# EAGLE design Adafruit MAX9744 (EAGLE 9.2.1)
AUTHOR: K. Townsend
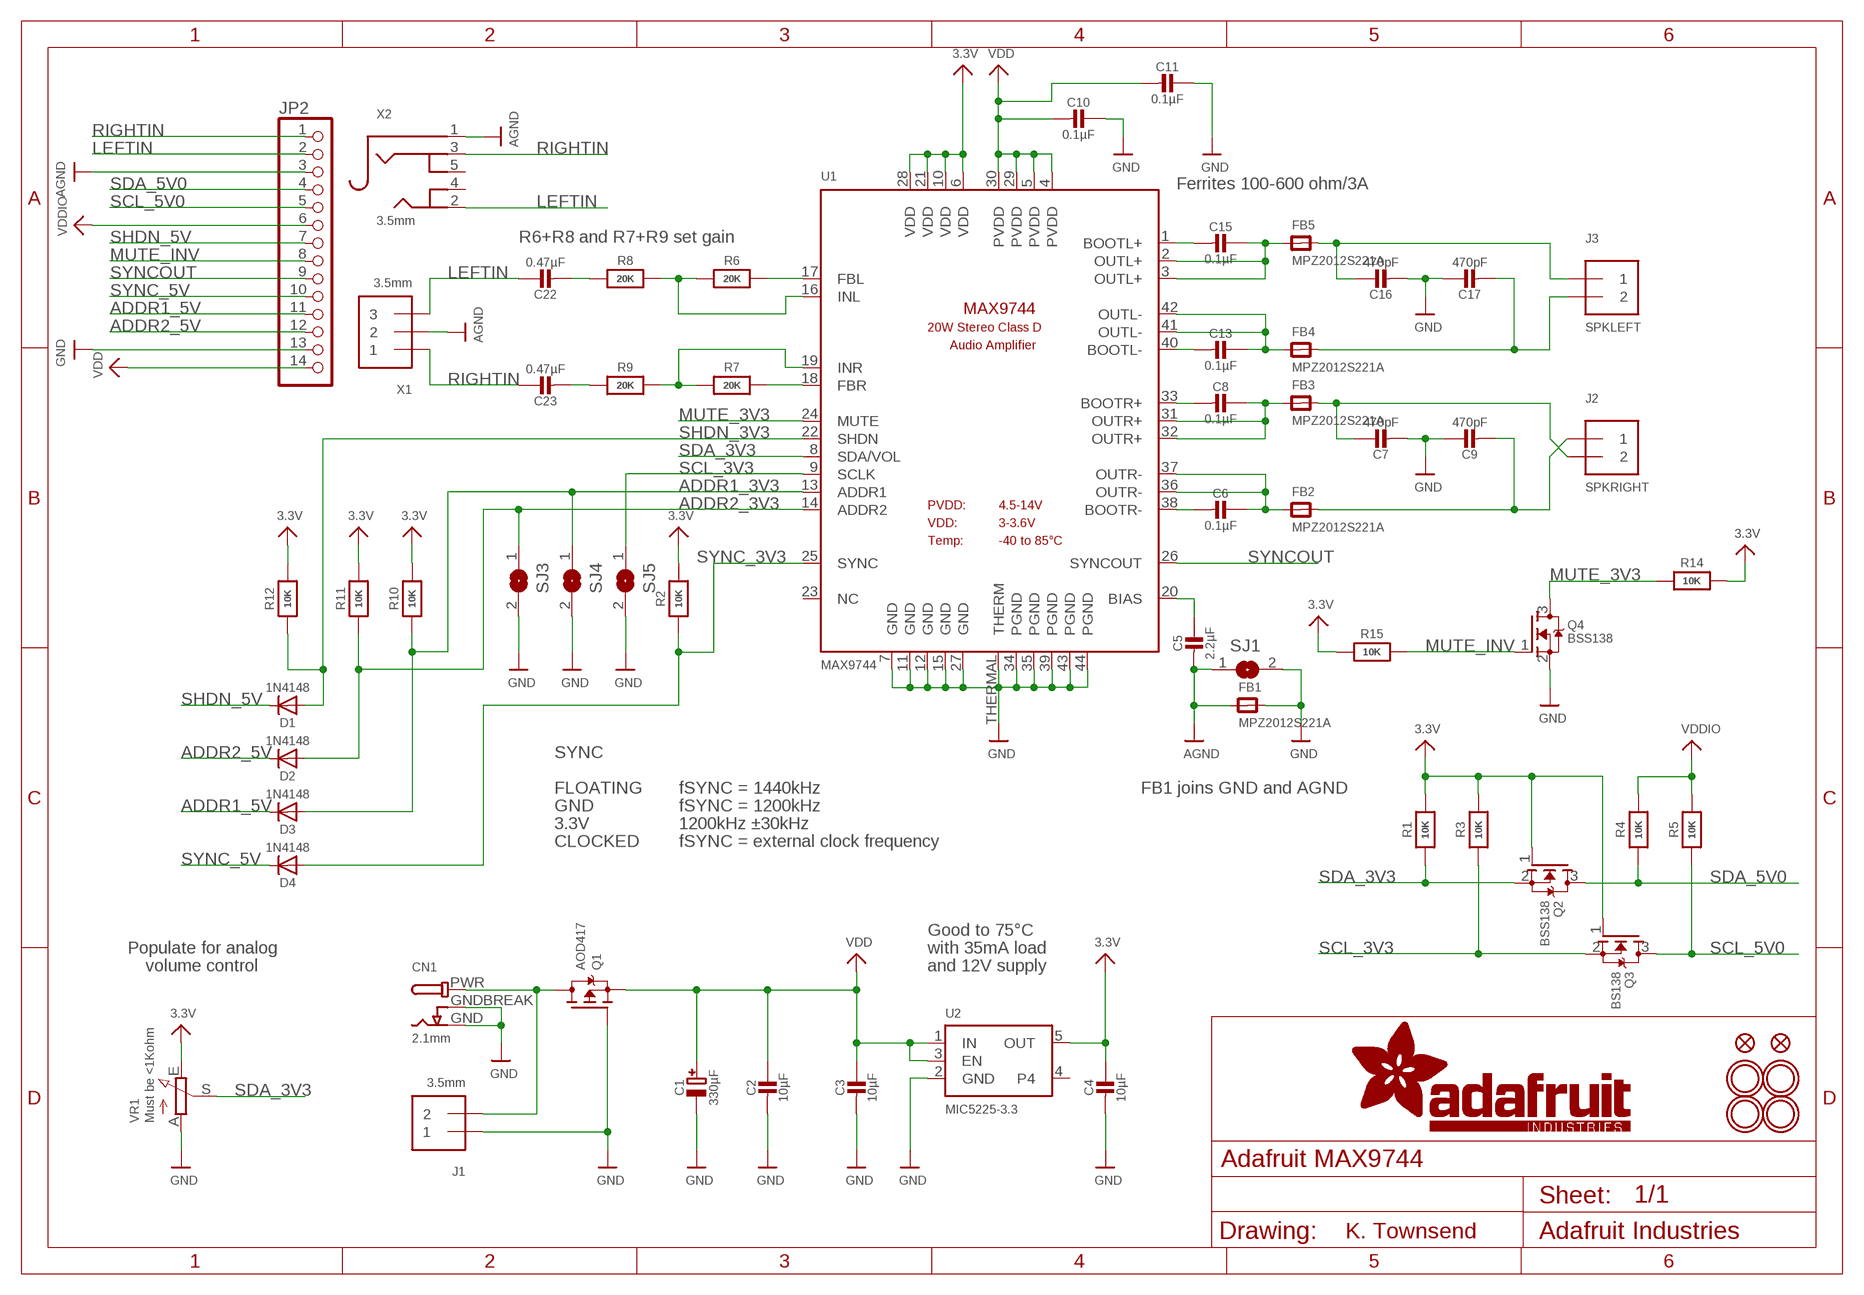
[diagram p0: schematic, sheet 1]

## Parts
C1  330µF  CAP_ELECTROLYTICPTH_3.5MMGRID_8MMDIA  [CELEC_3.5MM_8MM]
C2  10µF  CAP_CERAMIC0805-NOOUTLINE  [0805-NO]
C3  10µF  CAP_CERAMIC0805-NOOUTLINE  [0805-NO]
C4  10µF  CAP_CERAMIC0805-NOOUTLINE  [0805-NO]
C5  2.2µF  CAP_CERAMIC0805-NOOUTLINE  [0805-NO]
C6  0.1µF  CAP_CERAMIC0805-NOOUTLINE  [0805-NO]
C7  470pF  CAP_CERAMIC0805-NOOUTLINE  [0805-NO]
C8  0.1µF  CAP_CERAMIC0805-NOOUTLINE  [0805-NO]
C9  470pF  CAP_CERAMIC0805-NOOUTLINE  [0805-NO]
C10  0.1µF  CAP_CERAMIC0805-NOOUTLINE  [0805-NO]
C11  0.1µF  CAP_CERAMIC0805-NOOUTLINE  [0805-NO]
C13  0.1µF  CAP_CERAMIC0805-NOOUTLINE  [0805-NO]
C15  0.1µF  CAP_CERAMIC0805-NOOUTLINE  [0805-NO]
C16  470pF  CAP_CERAMIC0805-NOOUTLINE  [0805-NO]
C17  470pF  CAP_CERAMIC0805-NOOUTLINE  [0805-NO]
C22  0.47µF  CAP_CERAMIC0805-NOOUTLINE  [0805-NO]
C23  0.47µF  CAP_CERAMIC0805-NOOUTLINE  [0805-NO]
CN1  2.1mm  DCBARRELSMT_CORRECT  [DCJACK_2MM_SMT]
D1  1N4148  DIODESOD-323  [SOD-323]
D2  1N4148  DIODESOD-323  [SOD-323]
D3  1N4148  DIODESOD-323  [SOD-323]
D4  1N4148  DIODESOD-323  [SOD-323]
FB1  MPZ2012S221A  FERRITE_0805  [_0805]
FB2  MPZ2012S221A  FERRITE_0805  [_0805]
FB3  MPZ2012S221A  FERRITE_0805  [_0805]
FB4  MPZ2012S221A  FERRITE_0805  [_0805]
FB5  MPZ2012S221A  FERRITE_0805  [_0805]
FID1  FIDUCIAL""  [FIDUCIAL_1MM]
FID2  FIDUCIAL""  [FIDUCIAL_1MM]
J1  3.5mm  TERMBLOCK_1X2  [TERMBLOCK_1X2-3.5MM]
J2  SPKRIGHT  TERMBLOCK_1X2  [TERMBLOCK_1X2-3.5MM]
J3  SPKLEFT  TERMBLOCK_1X2  [TERMBLOCK_1X2-3.5MM]
JP2  HEADER-1X14  [1X14_ROUND70]
Q1  AOD417  MOSFET-PTO252  [TO252]
Q2  BSS138  MOSFET-NWIDE  [SOT23-WIDE]
Q3  BS138  MOSFET-NWIDE  [SOT23-WIDE]
Q4  BSS138  MOSFET-NWIDE  [SOT23-WIDE]
R1  10K  RESISTOR0805_NOOUTLINE  [0805-NO]
R2  10K  RESISTOR_0805MP  [_0805MP]
R3  10K  RESISTOR0805_NOOUTLINE  [0805-NO]
R4  10K  RESISTOR0805_NOOUTLINE  [0805-NO]
R5  10K  RESISTOR0805_NOOUTLINE  [0805-NO]
R6  20K  RESISTOR0805_NOOUTLINE  [0805-NO]
R7  20K  RESISTOR0805_NOOUTLINE  [0805-NO]
R8  20K  RESISTOR0805_NOOUTLINE  [0805-NO]
R9  20K  RESISTOR0805_NOOUTLINE  [0805-NO]
R10  10K  RESISTOR_0805MP  [_0805MP]
R11  10K  RESISTOR_0805MP  [_0805MP]
R12  10K  RESISTOR0805_NOOUTLINE  [0805-NO]
R14  10K  RESISTOR_0805MP  [_0805MP]
R15  10K  RESISTOR_0805MP  [_0805MP]
SJ1  SOLDERJUMPER  [SOLDERJUMPER_ARROW_NOPASTE]
SJ3  SOLDERJUMPER  [SOLDERJUMPER_ARROW_NOPASTE]
SJ4  SOLDERJUMPER  [SOLDERJUMPER_ARROW_NOPASTE]
SJ5  SOLDERJUMPER  [SOLDERJUMPER_ARROW_NOPASTE]
U1  MAX9744  AUDIOAMP_MAX9744  [TQFN44_7MM]
U2  MIC5225-3.3  VREG_SOT23-5  [SOT23-5]
U$29  MOUNTINGHOLE2.5_THICK  [MOUNTINGHOLE_2.5_PLATED_THICK]
U$38  MOUNTINGHOLE2.5_THICK  [MOUNTINGHOLE_2.5_PLATED_THICK]
U$39  MOUNTINGHOLE2.5_THICK  [MOUNTINGHOLE_2.5_PLATED_THICK]
U$40  MOUNTINGHOLE2.5_THICK  [MOUNTINGHOLE_2.5_PLATED_THICK]
VR1  Must be <1Kohm  TRIMPOT100MIL  [TRIMPOT_100MILPTH]
X1  3.5mm  TERMBLOCK_1X3  [TERMBLOCK_1X3-3.5MM]
X2  3.5mm  AUDIO_3.5MMJACK  [4UCONN_19269]

## Nets
3.3V: C4.1 Q2.1(G) Q3.1(G) R1.2 R2.2 R3.2 R10.2 R11.2 R12.2 R14.2 R15.1 U1.6(VDD) U1.10(VDD) U1.21(VDD) U1.28(VDD) U2.5(OUT) VR1.E
ADDR1_3V3: D3.A R10.1 SJ4.1 U1.13(ADDR1)
ADDR1_5V: D3.C JP2.11
ADDR2_3V3: D2.A R11.1 SJ3.1 U1.14(ADDR2)
ADDR2_5V: D2.C JP2.12
AGND: C5.2 FB1.1 JP2.3 SJ1.1 X1.2 X2.1
GND: C1.- C2.2 C3.2 C4.2 C7.2 C9.1 C10.1 C11.1 C16.2 C17.1 CN1.GND CN1.GNDBREAK FB1.2 J1.1 JP2.13 Q1.1(G) Q4.2(S) SJ1.2 SJ3.2 SJ4.2 SJ5.2 U1.7(GND) U1.11(GND) U1.12(GND) U1.15(GND) U1.27(GND) U1.34(PGND) U1.35(PGND) U1.39(PGND) U1.43(PGND) U1.44(PGND) U1.THERMAL(THERM) U2.2(GND) VR1.A
LEFTIN: C22.1 JP2.2 X1.3 X2.2
MUTE_3V3: Q4.3(D) R14.1 U1.24(MUTE)
MUTE_INV: JP2.8 Q4.1(G) R15.2
N$1: CN1.PWR J1.2 Q1.3(D)
N$3: C5.1 U1.20(BIAS)
N$5: C6.2 U1.38(BOOTR-)
N$6: C6.1 FB2.1 U1.36(OUTR-) U1.37(OUTR-)
N$7: C8.2 U1.33(BOOTR+)
N$8: C8.1 FB3.1 U1.31(OUTR+) U1.32(OUTR+)
N$9: C7.1 FB3.2 J2.2
N$10: C9.2 FB2.2 J2.1
N$13: C13.1 FB4.1 U1.41(OUTL-) U1.42(OUTL-)
N$16: C15.1 FB5.1 U1.2(OUTL+) U1.3(OUTL+)
N$17: C16.1 FB5.2 J3.1
N$18: C17.2 FB4.2 J3.2
N$23: C15.2 U1.1(BOOTL+)
N$24: C13.2 U1.40(BOOTL-)
N$25: R6.2 U1.17(FBL)
N$26: R7.2 U1.18(FBR)
N$27: R6.1 R8.2 U1.16(INL)
N$29: R7.1 R9.2 U1.19(INR)
N$30: C22.2 R8.1
N$31: C23.2 R9.1
RIGHTIN: C23.1 JP2.1 X1.1 X2.3
SCL_3V3: Q3.2(S) R3.1 SJ5.1 U1.9(SCLK)
SCL_5V0: JP2.5 Q3.3(D) R5.1
SDA_3V3: Q2.2(S) R1.1 U1.8(SDA/VOL) VR1.S
SDA_5V0: JP2.4 Q2.3(D) R4.1
SHDN_3V3: D1.A R12.1 U1.22(SHDN)
SHDN_5V: D1.C JP2.7
SYNC_3V3: D4.A R2.1 U1.25(SYNC)
SYNC_5V: D4.C JP2.10
SYNCOUT: JP2.9 U1.26(SYNCOUT)
VDD: C1.+ C2.1 C3.1 C10.2 C11.2 JP2.14 Q1.2(S) U1.4(PVDD) U1.5(PVDD) U1.29(PVDD) U1.30(PVDD) U2.1(IN) U2.3(EN)
VDDIO: JP2.6 R4.2 R5.2
Unconnected: U1.23(NC) U2.4 X2.4 X2.5

## Notes on the sheet
- Ferrites 100-600 ohm/3A
- R6+R8 and R7+R9 set gain
- SYNC
- FLOATING | fSYNC = 1440kHz | FB1 joins GND and AGND
- GND | fSYNC = 1200kHz
- 3.3V | 1200kHz ±30kHz
- CLOCKED | fSYNC = external clock frequency
- Good to 75°C
- Populate for analog | with 35mA load
- volume control | and 12V supply

## Library data of the parts
C1 = microbuilder:CAP_ELECTROLYTIC: Electrolytic Capacitors SMT PANASONIC_C - Size C Panasonic Electrolytic Aluminum Capacitor 47µF 16V 20% Electrolytic Capacitor [Digikey: PCE3890TR-ND] PANASONIC_D - Size D Panasonic Electrolytic Aluminum Capacitor 100µF 25V 20% Electrolytic Capacitor [Digikey: PCE3898TR-ND] PTH 3.5 mm grid, 8 mm diameter ... 3.5 mm grid, 10 mm diameter ...
C2-C11 C13 C15-C17 C22 C23 = microbuilder:CAP_CERAMIC: Ceramic Capacitors For new designs, use the packages preceded by an '_' character since they are more reliable: The following footprints should be used on most boards: _0402 - Standard footprint for regular board layouts _0603 - Standard footprint for regular board layouts _0805 - Standard footprint for regular board layouts _1206 - Standard footprint for regular board layouts For extremely tight-pitch boards where space is at a premium, the following 'micro-pitch' footprints can be used (smaller pads, no silkscreen outline, etc.): _0402MP - Micro-pitch footprint for very dense/compact boards _0603MP - Micro-pitch footprint for very dense/compact boards _0805MP - Micro-pitch footprint for very dense/compact boards _1206MP - Micro-pitch footprint for very dense/compact boards
CN1 = microbuilder:DCBARREL: DC Barrel Jack DCJACK_1.3MM_PTH - Through Hole 1.3mm Jack (4UConnector: 05536) DCJACK_2MM_PTH - Through Hole 2.0/2.1 Jack (4UConnector: 05537) DCJACK_2MM_SMT - SMT 2.0/2.1mm Jack(4UConnector: 03267)
D1-D4 = microbuilder:DIODE: Diode SMA Model Volts Amps Type Vf Ir Digikey # Notes SSA34-E3 40V 3A Schottky 480mV @ 3A 200uA @ 40V SSA34-E3/61TGITR-ND CDBA120-G 20V 1A Schottky 500mV @ 1A 500uA @ 20V 641-1014-6-ND REEL MBRA210 10V 2A Schottky 350mV @ 2A 700uA @ 10V MBRA210LT3 SOD-123 Model Volts Amps Type Vf Ir Order # Notes BAT54T1G 30V 200mA Schottky 800mV @ 200mA 2uA @ 25V BAT54T1GOSTR-ND B0530W 30V 500mA Schottky 430mV @ 500mA 130uA @ 30V B0530W-FDICT-ND REEL MBR120 20V 1A Schottky 340mV @ 1A MBR120VLSFT1GOSCT-ND SOD-323 Model Volts Amps Type Vf Ir Order # Notes PMEG2005EJ 20V 500mA Schottky 355mV @ 500mA 568-4110-1-ND ZLLS410 10V 570mA Schottky 380mV @ 570mA ZLLS410CT-ND 1N4148WS 75V 150mA Silicon/Simple 1V 1N4148WSFSCT-ND REEL SOD-523 Model Volts Amps Type Vf Ir Order # Notes BAT54XV2 30V 200mA Schottky 0.8V @ 100mA BAT54XV2CT-ND TB751S 30V 30mA Schottky RB751S-40TE61CT-ND SOT23-R/W (R = Solder Paste/Reflow Ovens, W = Hand-Soldering) Model Volts Amps Type Vf Ir Order # Notes BAT54FILM 40V 300mA Schottky 497-7162-1-ND POWERDI-5 Model Volts Amps Type Vf Ir Order # Notes PDS560 60V 5A Schottky 670mV @ 5A 150uA @ 60V PDS560DICT-ND
FB1-FB5 = microbuilder:FERRITE: Ferrite Bead 0603 MMZ1608B121C - 120 Ohm @ 100MHz, 600mA, 0.15 Ohm DC Resistance - Digikey: 445-2164-1-ND BK1608HW121-T - 120 Ohm, 600mA Ferrite Chip - Digikey: 587-1876-2-ND 0805 HZ0805B272R-10 - 2.7K Ohm @ 100MHz, 200mA, 0.8 Ohm DC Resistance - Digikey: 240-2504-1-ND (see also Murata BLM21BD272SN1L) MMZ2012Y152B - 1.5K Ohm @ 100MHz, 500mA, 0.4 Ohm DC Resistance - Digikey: 445-1560-1-ND - Mainly for high frequency (80-400MHz) MMZ2012R102A - 1K Ohm @ 100MHz, 500mA, 0.3 Ohm DC Resistance - Digikey: 445-1555-2-ND - More general purpose (10-200MHz)
FID1 FID2 = microbuilder:FIDUCIAL: Fiducial Alignment Points Various fiducial points for machine vision alignment.; BOM: EXCLUDE
J1-J3 = microbuilder:TERMBLOCK_1X2: 3.5mm Terminal block http://www.ladyada.net/library/pcb/eaglelibrary.html
JP2 = microbuilder:HEADER-1X14
Q1 = microbuilder:MOSFET-P: P-Channel Mosfet LEGEND VDS: Voltage Drain-Source ID: Drain Current RDS(ON): Drain-Source On-State Resistance VGS(TH): Gate-Source Threshold Voltage CISS: Drain-Source Input Capacitance SOT-23 Name VDS ID RDS(ON) VGS(TH) CISS Order Number IRLML5103 30V 760mA 600 mOhm -- 75pF @ 25V Digikey: IRLML5103PBFCT-ND IRLML6401 12V 4.3A 50 mOhm 950mV @ 250µA 830pF @ 10V Digikey: IRLML6401PBFTR-ND NTR0202PL 20V 400mA 800 mOhm 2.3V @ 250uA 70pF @ 5V Digikey: NTR0202PLT1GOSTR-ND NTR4101PT1G 20V 1.8A 85 mOhm 1.2V @ 250uA 675pF @ 10V Digikey: NTR4101PT1GOSCT-ND DMP2004K 20V 600mA 900 mOhm 1V @ 250uA 175pF @ 16V Digikey: DMP2004KDICT-ND PMV65XP 20V 3.9A 76 mOhm 950mV @ 1mA 725pF @ 20V Digikey: 568-2358-2-ND TO-252 Name VDS ID RDS(ON) VGS(TH) CISS Order Number AOD417 30V 25A 34 mOhm 3V @ 250µA 920pF @ 15V Digikey: 785-1106-2-ND
Q2-Q4 = microbuilder:MOSFET-N: N-Channel Mosfet LEGEND VDS: Voltage Drain-Source ID: Drain Current RDS(ON): Drain-Source On-State Resistance VGS(TH): Gate-Source Threshold Voltage CISS: Drain-Source Input Capacitance SOT-23 Name VDS ID RDS(ON) VGS(TH) CISS Order Number 2N7002E 60V 260mA 2.5 Ohm 2.5V @ 250uA 26.7pF @ 25V 2N7002ET1GOSTR-ND BSH103 30V 850mA 400 mOhm 400mV @ 1mA 83pF @ 24V BSH103,235-ND BSS138 60V 320mA 1.6 Ohm 1.5V @ 250uA 50pF @ 10V Mouser: 771-BSS138PW115 DMN2075U-7 20V 4.2A 38 mOhm 1V @ 250 uA 594.3pF @ 10V DMN2075U-7DICT-ND * BSS138 good choice for I2C level-shifting POWERPAK 1212-8 Name VDS ID RDS(ON) VGS(TH) CISS Order Number Si7308DN 60V 6A 58 mOhm 3V @ 250uA 665pF @ 15V SI7308DN-T1-E3CT-ND
R1-R12 R14 R15 = microbuilder:RESISTOR: Resistors For new designs, use the packages preceded by an '_' character since they are more reliable: The following footprints should be used on most boards: _0402 - Standard footprint for regular board layouts _0603 - Standard footprint for regular board layouts _0805 - Standard footprint for regular board layouts _1206 - Standard footprint for regular board layouts For extremely tight-pitch boards where space is at a premium, the following 'micro-pitch' footprints can be used (smaller pads, no silkscreen outline, etc.): _0402MP - Micro-pitch footprint for very dense/compact boards _0603MP - Micro-pitch footprint for very dense/compact boards _0805MP - Micro-pitch footprint for very dense/compact boards _1206MP - Micro-pitch footprint for very dense/compact boards
SJ1 SJ3-SJ5 = microbuilder:SOLDERJUMPER: SMD Solder JUMPER Solder the two pads together to create a connection, or remove the solder to break it. REFLOW - Use this footprint for solder paste and reflow ovens. WAVE - Use this footprint for hand-soldering (larger pads). CLOSED - Has a trace between the two pads to ensure it is closed by default. The trace needs to be cut to disable the jumper, and can be closed again by creating a solder bridge between the two pads.; BOM: EXCLUDE
U1 = microbuilder:AUDIOAMP_MAX9744: MAX9744 - 20W Class D Stereo Speaker Amplifier with I2C Volume Control PVDD: 4.5-14V VDD: 3-3.6V Temp: -40°C to +85°C
U2 = microbuilder:VREG_SOT23-5: SOT23-5 Fixed Voltage Regulators Part Current Out V Out V In V Dropout θJA (°C/W) TJ (°C) Digikey Part No. ADP121 150mA 3.3V 3.4-5.5V 0.09V @ 150mA -- -- ADP121-AUJZ33R7CT-ND ADP121 150mA 3.0V 3.1-5.5V 0.09V @ 150mA -- -- ADP121-AUJZ30R7CT-ND ADP122 300mA 3.3V 3.4-5.5V 0.085V @ 300mA -- -- ADP122AUJZ-3.3-R7CT-ND ADP1712 300mA 3.3V 3.5-5.5V 0.17V @ 300mA -- -- ADP1712AUJZ-3.3-R7TR-ND AP7311 (Low Cost) 150mA 3.3V 3.5-6V 0.15V @ 150mA -- -- AP7311-33WG-7DICT-ND LD39015M18R 150mA 1.8V 1.9V-5.5V 0.08V @ 100mA -- -- 497-6977-1-ND LP2985A-33DBVR 150mA 3.3V 3.3-16V 0.28V @ 150mA 206 150 296-18479-1-ND MCP1824T-3302E/OT 300mA 3.3V 3.5V-6V 0.2V @ 300mA -- -- MCP1824T-3302E/OTCT-ND MIC5205-2.5YM5 TR 150mA 2.5V 2.7-16V 0.165V @ 150mA -- -- 576-1257-2-ND MIC5205-3.0YM5 TR 150mA 3.0V 3.2V-16V 0.165V @ 150mA -- -- 576-1258-2-ND MIC5205-3.3YM5 TR 150mA 3.3V 3.5V-16V 0.165V @ 150mA -- -- 576-1259-2-ND TPS780330220 150mA 3.3V+2.2V 3.6-5.5V 250mV Max -- -- 296-23332-1-ND TDA3663/N1,135 100mA 3.3V 3.5-45V 0.18V @ 50mA -- -- 568-5343-1-ND Max operating temp can be calculated using θJA, TJ (max junction temperature), and power in watts. Set the "Maximum Ambient Temperature" until it reaches TJ ("Max Junction Temperature"), which is the absolute limit for safe use of the regulator: Heat Sink Temperature Calculator <http://www.daycounter.com/Calculators/Heat-Sink-Temperature-Calculator.phtml> For example, With 12V source into a 3.3V LP2985 and a 30mA load, we are dissipating (12V-3.3V) * 0.03A = 0.261W. With a θJA of 206 °C/W, a TJ of 150°C, and 261mW we can safely use the chip without a heat sink up to 75°C (=147.1°C Junction Temperature).
U$29 U$38-U$40 = microbuilder:MOUNTINGHOLE: Mounting Hole For #2 screws (0.086"/2.18mm width, 0.094"/2.4mm hole) use 2.5mm; BOM: EXCLUDE
VR1 = microbuilder:TRIMPOT: 3-Pin SMT Trimpots Bourns TC33 (X-2) Series 1K - Digikey: TC33X-102ECT-ND 10K - Digikey: TC33X-2-103E 100K - Digikey: TC33X-104ECT-ND Bourns 3303 (W) Series 3mm 10K Single Turn - Digikey: 3303W-103ETR-ND 3mm 100K Single Turn - Digikey: 3303X-104ETR-ND
X1 = microbuilder:TERMBLOCK_1X3: 3.5mm Terminal block http://www.ladyada.net/library/pcb/eaglelibrary.html
X2 = microbuilder:AUDIO_3.5MMJACK: 3.5MM Audio Jack These are normally connected as follows, from left-to right on the schematic symbol above: Tip: Left Audio Inner Ring: Right Audio Shell: Common/GND

## Board
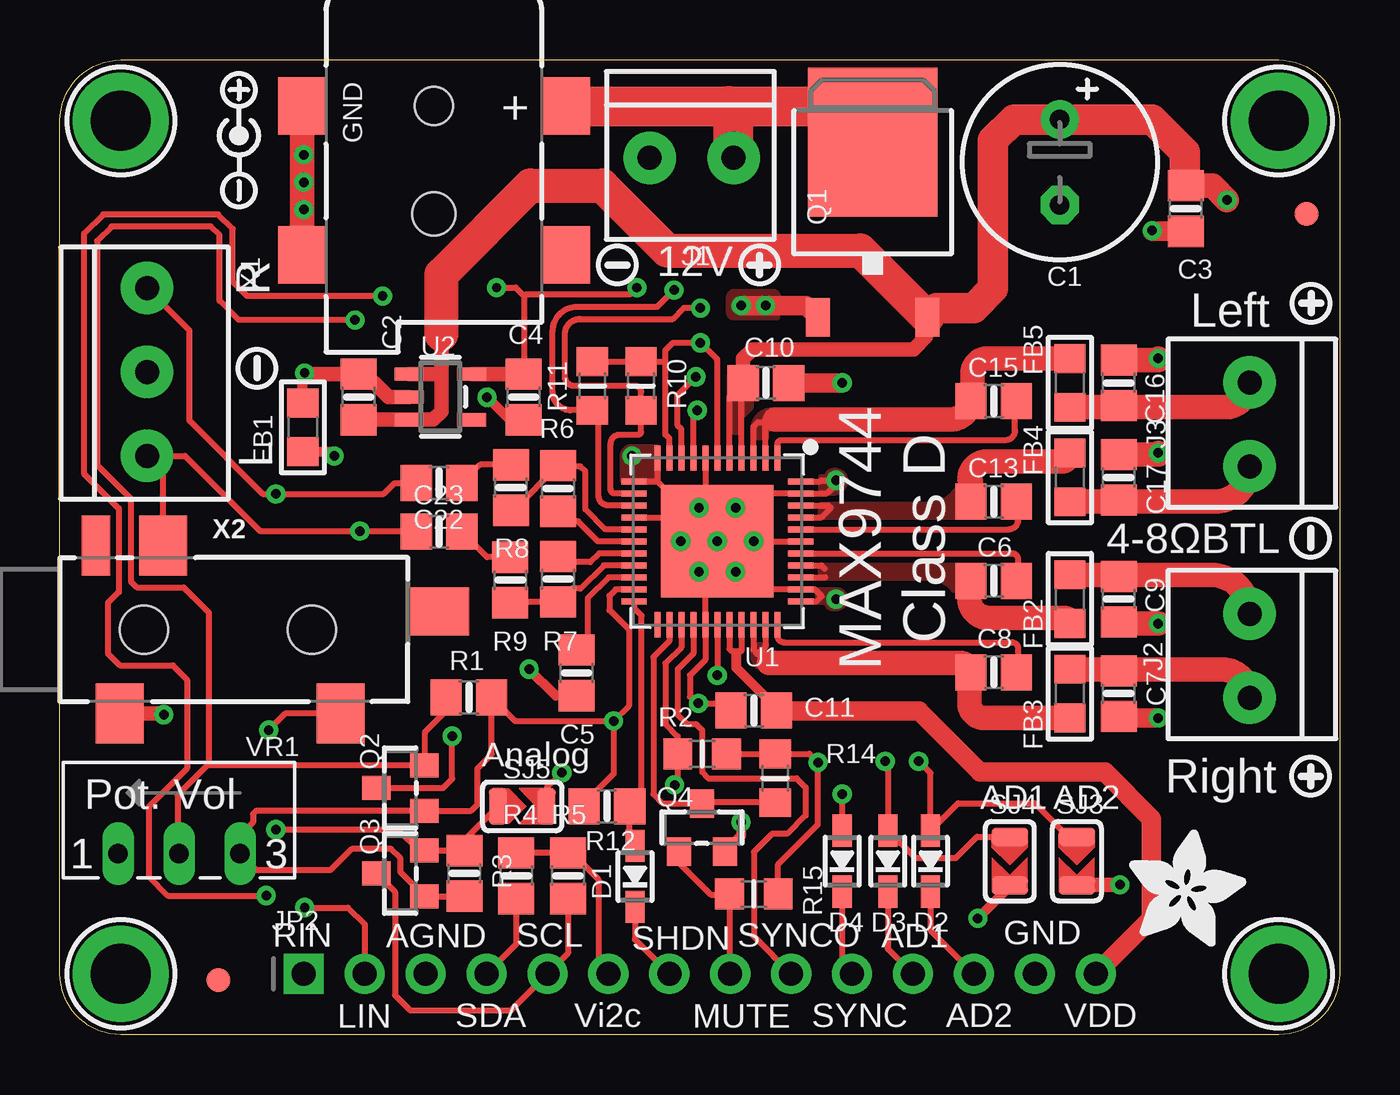
[diagram p1: board, top side]
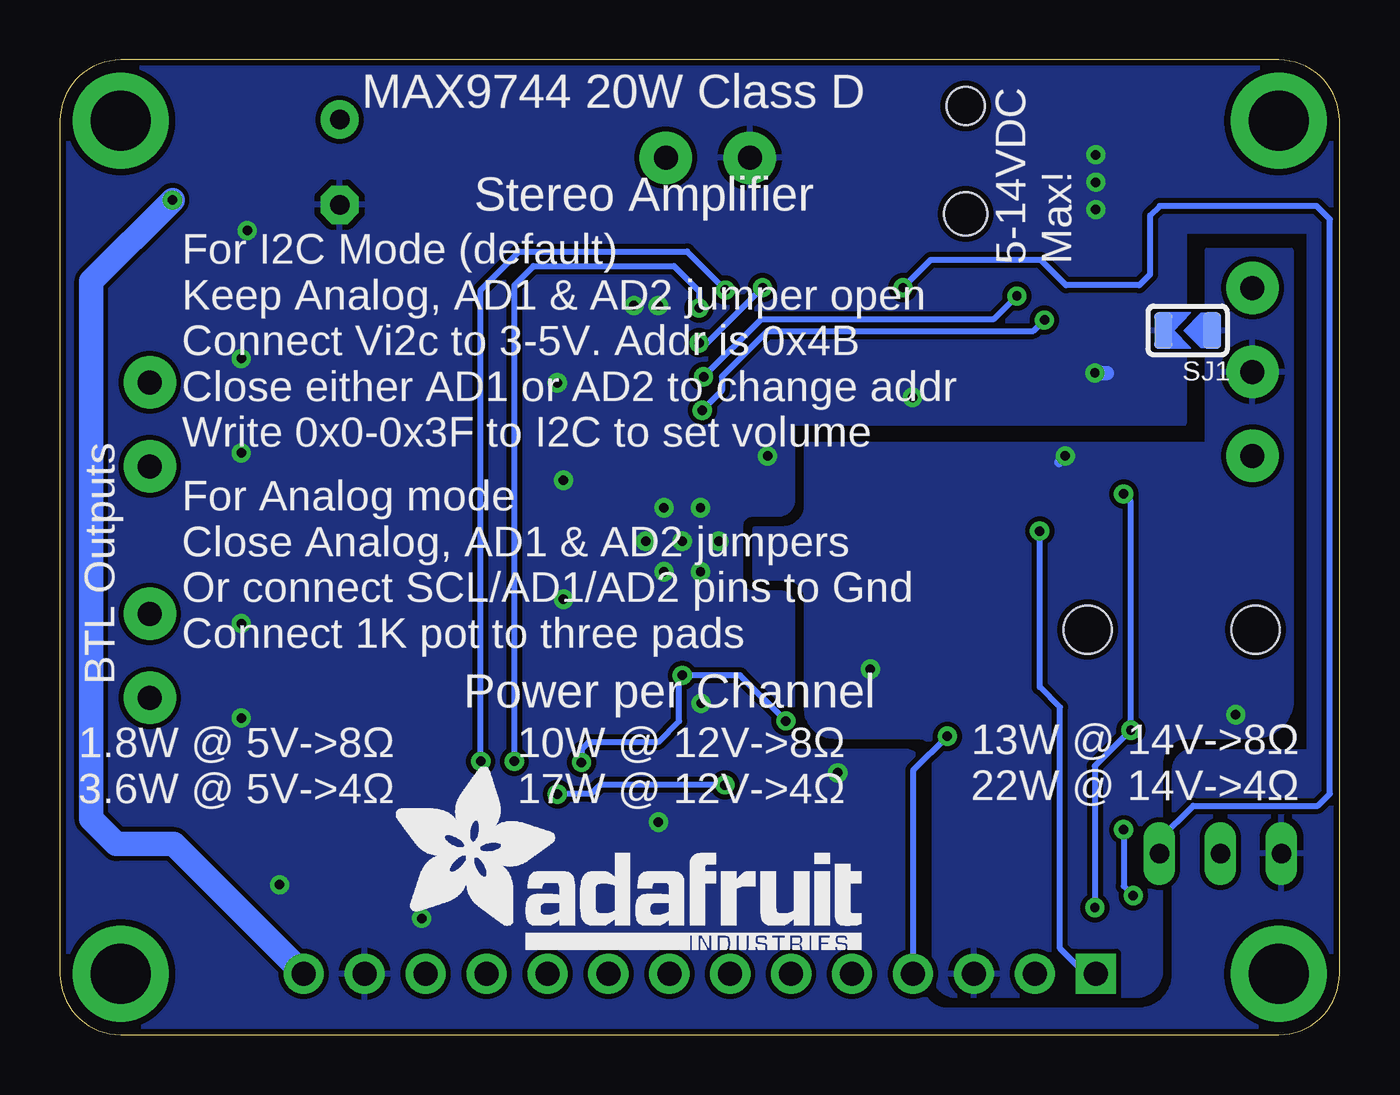
[diagram p2: board, bottom side, seen from below]

Size 53.34 x 40.64 mm. Coordinates in mm from the lower left corner, seen from the top.
Outline: 2.54,40.64 50.8,40.64 arc-90 53.34,38.1 53.34,2.54 arc-90 50.8,0 2.54,0 arc-90 0,2.54 0,38.1 arc-90 2.54,40.64
Copper layers (1*16): Top 0.035mm / dielectric 1.5mm / Bottom 0.035mm
Design rules "adafruit *": minimum track width 10mil, minimum drill 15.5mil, track to track 8mil, track to pad 8mil, pad to pad 8mil, via to via 8mil, smd to smd 8mil, copper to edge 10mil, drill to drill 8mil, minimum pad ring 10mil, minimum via ring 8mil, stop-mask expansion 4mil, vias tented up to drill 20mil, thermal gap 10mil
tRestrict: area 29.1,23.7 to 29.2,24.6; area 28.1,24 to 28.2,24.9; area 30.4,22.7 to 31.2,22.9; area 30.4,21.7 to 31.2,21.8; area 30.5,19.3 to 31.4,19.4; area 30.5,18.8 to 31.4,18.9

### Footprints (pad centres in the part's own frame; a part is rotated, then mirrored left to right if it is on the bottom)
CELEC_3.5MM_8MM = drill 0.813 pad 1.6: + -1.778,0 | drill 0.813 pad 1.6 octagon: - 1.778,0
0805-NO = smd 1.3 x 1.5: 1 -0.95,0; 2 0.95,0
DCJACK_2MM_SMT = smd 2.4 x 2: GND 0,-5.5; GNDBREAK 6.2,-5.5; PWR 0,5.5; PWR2 6.2,5.5 | hole 1.6: 0,0 | hole 1.8: 4.5,0
SOD-323 = smd 1.35 x 0.8: A 1.27,0; C -1.27,0
_0805 = smd 1.2 x 1.3: 1 -1.016,0; 2 1.016,0
FIDUCIAL_1MM = smd 1 x 1: 1 0,0
TERMBLOCK_1X2-3.5MM = drill 1 pad 2.184: 1 1.8,0; 2 -1.7,0
1X14_ROUND70 = drill 1 pad 1.676 square: 1 -16.51,0 | drill 1 pad 1.676: 2 -13.97,0; 3 -11.43,0; 4 -8.89,0; 5 -6.35,0; 6 -3.81,0; 7 -1.27,0; 8 1.27,0; 9 3.81,0; 10 6.35,0; 11 8.89,0; 12 11.43,0; 13 13.97,0; 14 16.51,0
TO252 = smd 1 x 1.6: 1 -2.28,-4.8; 2 2.28,-4.8 | smd 5.4 x 6.2: 3 0,2.5
SOT23-WIDE = smd 1 x 1.2: 1 -0.95,-1; 2 0.95,-1; 3 0,1
_0805MP = smd 1.2 x 1.3: 1 -1.016,0; 2 1.016,0
SOLDERJUMPER_ARROW_NOPASTE = smd 0.762 x 1.524: 1 -1.016,0; 2 1.016,0
TQFN44_7MM = smd 0.25 x 1.05: 1 -2.5,-3.475; 2 -2,-3.475; 3 -1.5,-3.475; 4 -1,-3.475; 5 -0.5,-3.475; 6 0,-3.475; 7 0.5,-3.475; 8 1,-3.475; 9 1.5,-3.475; 10 2,-3.475; 11 2.5,-3.475; 23 2.5,3.475; 24 2,3.475; 25 1.5,3.475; 26 1,3.475; 27 0.5,3.475; 28 0,3.475; 29 -0.5,3.475; 30 -1,3.475; 31 -1.5,3.475; 32 -2,3.475; 33 -2.5,3.475 | smd 1.05 x 0.25: 12 3.475,-2.5; 13 3.475,-2; 14 3.475,-1.5; 15 3.475,-1; 16 3.475,-0.5; 17 3.475,0; 18 3.475,0.5; 19 3.475,1; 20 3.475,1.5; 21 3.475,2; 22 3.475,2.5; 34 -3.475,2.5; 35 -3.475,2; 36 -3.475,1.5; 37 -3.475,1; 38 -3.475,0.5; 39 -3.475,0; 40 -3.475,-0.5; 41 -3.475,-1; 42 -3.475,-1.5; 43 -3.475,-2; 44 -3.475,-2.5 | smd 4.7 x 4.7: THERMAL 0,0
SOT23-5 = smd 0.55 x 1.2: 1 -0.95,-1.3; 2 0,-1.3; 3 0.95,-1.3; 4 0.95,1.3; 5 -0.95,1.3
MOUNTINGHOLE_2.5_PLATED_THICK = drill 2.5 pad 4: P$1 0,0
TRIMPOT_100MILPTH = drill 0.813 long: A 2.54,1.27; E -2.54,1.27; S 0,1.27
TERMBLOCK_1X3-3.5MM = drill 1 pad 2.184: 1 3.55,0; 2 0.05,0; 3 -3.45,0
4UCONN_19269 = smd 2 x 2.5: 1 2.5,-3.5; 2 11.7,-3.5; 3 4.3,3.5 | smd 2.5 x 2: 4 15.8,0.75 | smd 1.2 x 2.5: 5 1.5,3.5 | hole 2: 3.5,0; 10.5,0

### Placement (x,y rotation side)
C1  41.68,36.38 270 top
C2  12.45,26.59 90 top
C3  46.93,34.44 270 top
C4  19.32,26.59 270 top
C5  21.53,15.09 270 top
C6  38.92,18.92 0 top
C7  44.13,14.22 270 top
C8  38.92,15.11 0 top
C9  44.13,18.16 90 top
C10  29.43,27.18 180 top
C11  28.92,13.51 0 top
C13  38.92,22.23 0 top
C15  38.92,26.42 0 top
C16  44.13,27.18 90 top
C17  44.13,23.24 270 top
C22  15.8,23 0 top
C23  15.8,20.97 0 top
CN1  15.59,38.72 270 top
D1  23.97,6.6 90 top
D2  36.29,7.24 90 top
D3  34.51,7.24 90 top
D4  32.61,7.24 90 top
FB1  10.12,25.32 90 top
FB2  42.1,18.16 90 top
FB3  42.1,14.22 90 top
FB4  42.1,23.24 270 top
FB5  42.1,27.18 270 top
FID1  51.97,34.22 0 top
FID2  6.6,2.29 0 top
J1  26.38,36.56 180 top
J2  49.59,15.75 90 top
J3  49.59,25.4 90 top
JP2  26.67,2.54 0 top
Q1  33.88,34.71 0 top
Q2  14.19,10.29 90 top
Q3  14.19,6.73 90 top
Q4  26.77,8.64 0 top
R1  17.05,14.06 0 top
R2  26.77,11.71 0 top
R3  16.86,6.73 270 top
R4  19.02,6.63 90 top
R5  21.18,6.63 90 top
R6  20.76,22.78 270 top
R7  20.76,18.99 90 top
R8  18.8,22.81 270 top
R9  18.77,18.96 270 top
R10  24.23,27.05 90 top
R11  22.19,27.05 90 top
R12  22.8,9.53 180 top
R14  29.81,10.7 90 top
R15  28.92,5.87 180 top
SJ1  6.33,29.36 180 bottom
SJ3  42.39,7.24 270 top
SJ4  39.59,7.24 270 top
SJ5  19.27,9.53 0 top
U1  27.4,20.57 180 top
U2  15.86,26.59 270 top
U$28  [ADAFRUIT_TEXT_20MM]  39.5,3.56 0 bottom
U$29  2.54,2.54 0 top
U$32  [ADAFRUIT_5MM]  44.58,3.68 0 top
U$38  50.8,2.54 0 top
U$39  2.54,38.1 0 top
U$40  50.8,38.1 0 top
U$41  [ICON_POSITIVE_CENTER-M]  7.46,37.48 270 top
U$42  [ICON_PLUS]  29.17,32.09 0 top
U$43  [ICON_MINUS]  23.24,32.09 0 top
U$47  [ICON_MINUS]  8.21,27.79 90 top
U$50  [ICON_PLUS]  52.16,30.5 0 top
U$51  [ICON_MINUS]  52.13,20.7 90 top
U$52  [ICON_PLUS]  52.13,10.78 0 top
VR1  4.96,8.82 180 top
X1  3.63,27.69 270 top
X2  0,16.89 0 top

### Tracks (layer width: path | path; a pad name or v marks a point on that pad's centre or on a via)
3.3V  (via drill 0.39)
  Top 0.254: 7.49,7.56 VR1.E | VR1.E | R11.2 R10.2 25.24,28.07 | U1.28 v27.4,14.99 | U1.10 25.4,24.86 25.24,25.02 25.24,28.07 | R15.1 29.94,7.11 31.59,8.76 v31.59,11.34 v31.6,11.35 31.24,11.71 R14.2 R2.2 | VR1.E 8.2,6.86 11.27,6.86 12.16,7.75 13.81,7.75 14.19,7.37 14.19,6.78 Q3.1 15.26,5.71 15.32,5.78 R3.2 | v23.08,13.08 23.72,13.72 23.72,16.89 22.9,17.71 22.9,18.3 23.17,18.57 U1.21 | v23.08,13.08 23.08,10.88 21.85,9.65 R12.2 | 25.24,28.07 25.24,28.54 25.55,28.85 v26.7,28.85 27.4,28.15 U1.6 | 19.35,30.8 19.35,27.57 C4.1 | VR1.E 7.42,7.63 7.42,8.22 8.05,8.85 8.05,9.2 8.19,9.34 Q2.1 17.14,9.34 17.4,9.6 17.4,11.1 18,11.7 R1.2 18.98,13.08 v23.08,13.08 | v18.2,31.15 19,31.15 19.35,30.8 | v24.05,31.15 23.76,30.86 19.41,30.86 19.35,30.8
  Top 0.61: U2.5 C4.1
  Bottom 0.254: v23.08,13.08 24.99,14.99 v27.4,14.99 27.53,14.86 27.53,13.08 28.42,12.19 31.31,12.19 31.6,11.9 v31.6,11.35 31.65,11.35 | v26.7,28.85 26.35,28.85 v24.05,31.15 | VR1.E 7.5,8.15 6.1,9.55 0.9,9.55 0.4,10.05 0.4,34 0.95,34.55 7.5,34.55 7.9,34.15 7.9,31.7 8.35,31.25 11.4,31.25 12.45,32.3 17.05,32.3 v18.2,31.15
ADDR1_3V3  (via drill 0.39)
  Top 0.254: U1.13 23.11,22.57 arc-90 22.95,22.73 22.95,24.64 arc-90 23.34,25.02 24.1,25.02 arc90 24.23,25.15 R10.1 24.23,26.8 arc90 23.97,27.05 21.43,27.05 arc-90 21.05,27.43 21.05,29.21 arc-90 21.68,29.84 25.55,29.84 26,30.3 v26.7,30.3 | v34.4,11.4 34.51,11.4 D3.A 35.66,7.37 37.34,7.37 38.23,8.26 SJ4.1
  Bottom 0.254: v34.4,11.4 34.4,31.25 33.6,32.05 27.75,32.05 26.7,31 v26.7,30.3
ADDR1_5V
  Top 0.254: D3.C 34.51,3.59 JP2.11
ADDR2_3V3  (via drill 0.39)
  Top 0.254: U1.14 22.85,22.07 arc-90 22.45,22.48 22.45,25.91 22.32,25.91 R11.1 21.3,26.04 arc-90 20.54,26.8 20.54,29.34 arc-90 21.56,30.35 24.9,30.35 v25.6,31.05 | v35.8,11.4 36.29,10.91 D2.A 37.43,9.65 40.64,9.65 42.04,8.26 SJ3.1
  Bottom 0.254: v35.8,11.4 35.8,31.05 34.2,32.65 27.2,32.65 v25.6,31.05
ADDR2_5V
  Top 0.254: D2.C 36.29,4.35 JP2.12
AGND  (via drill 0.39)
  Top 0.406: FB1.1 11.25,24.31 v11.43,24.13 | C5.2 20.66,14.14 v19.56,15.24
  Top 0.61: X2.1 4.33,13.39 v4.33,13.34
  Bottom 0.406: v11.43,24.13 11.68,23.88 | 19.56,14.99 v19.56,15.24
  pour Bottom: 7.49,2.54 arc90 8.64,1.65 15.97,1.65 arc90 16.86,2.54 16.86,11.68 arc-90 17.49,12.45 21.05,12.45 arc90 22.19,13.59 22.19,18.16 arc-90 23.08,19.05 24.35,19.05 24.35,21.08 23.21,21.08 arc-90 22.19,22.1 22.19,24.6 5.5,24.6 5.5,32.7 2.03,32.7 2.03,13.97 arc90 3.56,12.45 6.35,12.45 arc-90 7.49,11.3
GND  (via drill 0.39)
  Top 0.254: U1.39 U1.THERMAL 26.9,20.07 U1.27 26.9,15.63 26.26,14.99 26.26,14.1 26.54,13.82 v26.61,13.82 27.6,13.82 | U1.11 24.9,23.07 25.24,22.73 | 25.24,22.73 25.24,21.72 25.1,21.57 U1.15 | U1.12 24.82,23.07 24.86,23.11 | U1.7 26.9,22.87 26.77,22.73 25.24,22.73 | 29.27,22.57 U1.43 31.97,22.57 32.38,22.99 32.38,23.11 | 29.4,18.57 U1.35 31.46,18.57 31.75,18.29 31.54,18.07 U1.34 | C4.2 18.75,25.64 | U1.44 31.71,23.07 31.75,23.11 v32.35,23.11 | SJ5.2 20.29,10.29 v20.92,10.92
  Top 0.406: FB1.2 10.12,27.52 v10.2,27.59 | v28.39,8.87 28.39,8.31 Q4.2 | SJ4.2 39.59,6.18 v38.26,4.85 | 27.6,13.82 27.67,13.82 C11.1 | v17.8,26.57 17.82,26.57 18.75,25.64 | 10.09,36.76 v10.16,36.69
  Top 0.61: U2.2 13.7,26.59 13.1,27.19 12.8,27.19 C2.2 10.25,27.54 v10.2,27.59 10.26,27.54 | 38.32,4.92 v38.26,4.85 | v44.19,6.25 42.42,6.25 SJ3.2
  Top 0.813: C10.1 v32.61,27.18 | C3.2 45.57,33.49 arc-90 v45.53,33.53 | C7.2 44.2,13.21 v45.78,13.21 | Q1.1 31.1,30.4 v28.4,30.4
  Top 1.016: CN1.GNDBREAK 10.09,36.76 CN1.GND | v45.78,17.14 44.13,17.14 C9.1 | C16.2 45.78,28.13 v45.78,28.19 | C17.1 45.78,24.19 v45.78,24.26
  Bottom 0.61: v10.2,27.59 9.7,27.59
  other vias: 10.16,34.4 10.16,35.54 25.88,20.57 28.16,21.97 28.16,19.3 26.64,19.3 32.35,18.16 23.84,24.13 27.4,20.57 29.42,30.4 28.92,20.57 26.64,21.97
  pour Bottom: 0,33.4 0,0 54.04,0 54.04,41.01 -0.25,41.01 0.13,33.5 6.5,33.5 6.5,25.5 22.83,25.5 22.83,22.35 arc90 23.34,21.72 24.48,21.72 arc-90 24.99,21.21 24.99,18.92 arc-90 24.48,18.41 23.34,18.41 arc90 22.83,17.91 22.83,11.81 18.13,11.81 arc90 17.49,11.18 17.49,2.16 arc-90 16.35,1.02 8.38,1.02 arc-90 6.86,2.54 6.86,11.05 arc90 6.1,11.81 1.25,11.8 1.25,33.4
  pour Top (no thermals): 31.72,22.61 32.23,22.61 arc90 32.73,23.11 arc90 32.35,23.5 32.23,23.5 arc90 31.97,23.24 31.72,23.24
  pour Top (no thermals): 31.59,18.54 32.35,18.54 arc-90 32.73,18.16 arc-90 32.35,17.78 32.23,17.78 arc-90 31.97,18.03 31.59,18.03
  pour Top (no thermals): 24.86,23.11 23.46,23.11 23.46,24.13 arc-90 23.84,24.51 24.86,24.51
  pour Top (no thermals): 28.15,29.9 arc-90 27.89,30.1 27.89,30.73 arc-90 28.15,30.99 29.69,30.99 arc-90 29.94,30.73 29.89,29.9
LEFTIN  (via drill 0.39)
  Top 0.254: v10.2,5.3 12,5.3 12.7,4.6 JP2.2 | C22.1 13.95,23 13.5,22.55 v9,22.55 8.45,22.55 5.4,25.6 5.4,29.36 X1.3 | X2.2 9.39,13.39 v8.7,12.7
  Bottom 0.254: v10.2,5.3 10.2,11.2 v8.7,12.7 8.7,22.25 v9,22.55
MUTE_3V3
  Top 0.254: U1.24 25.4,16.41 24.73,15.75 24.73,10.03 25.11,9.65 26.75,9.65 Q4.3 26.81,9.68 R14.1
MUTE_INV
  Top 0.254: Q4.1 25.82,7.17 27.15,5.84 27.88,5.84 R15.2 27.91,2.57 JP2.8
N$1
  Top 1.676: CN1.PWR 27.87,38.72 | 27.87,38.72 32.37,38.72 Q1.3 | J1.2 28.08,38.51 27.87,38.72
N$3
  Top 0.254: U1.20 22.87,19.07 22,18.2 22,16.5 C5.1
N$5
  Top 0.254: U1.38 39.68,20.07 arc-90 39.94,19.81 39.94,18.99 C6.2
N$6
  Top 0.254: U1.37 31.73,19.57 31.88,19.43 | U1.36 31.9,19.07
  Top 1.016: 42,17.25 arc-90 FB2.1 arc90 41.87,17.37 38.8,17.37 arc-90 37.91,18.14 37.91,18.86 C6.1
  pour Top (no thermals): 31.72,19.56 38.29,19.56 38.29,18.54 37.27,18.54 arc45 36.38,19.05 31.72,19.05
N$7
  Top 0.254: U1.33 29.9,16.65 arc90 30.19,16.36 39.69,16.36 arc-90 39.94,16.1 39.94,15.18 C8.2
N$8
  Top 0.254: U1.31 28.9,16.06 29.08,15.88 29.4,16.19 U1.32
  Top 1.016: FB3.1 38.54,13.21 arc-90 37.91,13.84 37.91,15.05 C8.1 arc90 37.4,15.49 29.56,15.49
  pour Top (no thermals): 28.92,16.26 29.43,16.26 29.43,16.13 arc90 29.69,15.88 29.69,15.24 29.43,15.24 arc-90 28.92,15.75
N$9
  Top 1.016: J2.2 arc90 48.4,15.24 44.13,15.24 | FB3.2 44.13,15.24 | 44.13,15.24 C7.1
N$10
  Top 1.016: J2.1 arc90 47.96,19.18 44.13,19.18 | FB2.2 44.13,19.18 | 44.13,19.18 C9.2
N$13
  Top 0.254: U1.42 32.03,22.07 32.13,21.97 31.73,21.57 U1.41
  Top 1.016: 42,24.16 arc90 FB4.1 arc-90 41.74,23.9 38.67,23.9 arc90 37.91,23.14 37.98,23.07 C13.1
  pour Top (no thermals): 31.72,22.1 36.38,22.1 arc45 37.4,22.73 38.29,22.73 38.29,21.59 31.72,21.59
N$16
  Top 0.254: U1.2 29.4,25.46 29.34,25.53 29.08,25.53 28.9,25.34 U1.3
  Top 1.016: FB5.1 38.67,28.19 arc90 38.04,27.56 38.04,26.48 C15.1 arc-90 37.02,25.65 29.81,25.65
  pour Top (no thermals): 28.92,24.89 28.92,25.27 arc-90 29.69,26.04 29.81,26.04 29.81,25.27 29.56,25.27 arc90 29.43,25.15 29.43,24.89
N$17
  Top 1.016: J3.1 arc-90 48.55,26.16 44.13,26.16 | FB5.2 44.13,26.16 | 44.13,26.16 C16.1
N$18
  Top 1.016: J3.2 arc-90 48.12,22.23 44.13,22.23 | FB4.2 44.13,22.23 | 44.13,22.23 C17.2
N$23
  Top 0.254: U1.1 29.9,24.6 arc-90 30.09,24.79 39.41,24.79 arc90 39.81,25.2 39.81,26.36 C15.2
N$24
  Top 0.254: U1.40 39.55,21.07 arc90 39.94,21.46 39.94,22.23 C13.2
N$25
  Top 0.254: U1.17 22.43,20.57 21.6,21.4 21.19,21.4 R6.2
N$26
  Top 0.254: U1.18 22.47,20.07 22.1,19.7 21,19.7 R7.2
N$27
  Top 0.254: U1.16 22.73,21.07 21.9,21.9 21.9,23.5 21.7,23.7 20.79,23.7 R6.1 18.9,21.86 R8.2
N$29
  Top 0.254: U1.19 22.67,19.57 21.7,18.6 21.32,18.6 R7.1 18.8,18.04 R9.2
N$30
  Top 0.254: R8.1 17.52,23.76 C22.2
N$31
  Top 0.254: R9.1 17.81,19.91 C23.2
RIGHTIN  (via drill 0.39)
  Top 0.254: X2.3 4.3,23.46 X1.1 5.21,24.14 8.35,21 v12.5,21 14.82,21 C23.1
  Bottom 0.254: 3.77,24 X1.1 | v12.5,21 12.5,14.5 11.65,13.65 11.65,3.6 10.59,2.54 JP2.1
SCL_3V3  (via drill 0.39)
  Top 0.254: v26.51,27.43 25.75,26.67 25.75,25.4 25.9,25.25 U1.9 | SJ5.1 16.86,8.13 R3.1 Q3.2 14.97,7.68 14.1,8.55 v9,8.55 | v13.45,30.8 7.8,30.8 7.2,31.4 7.2,33.6 6.6,34.2 1.8,34.2 1,33.4 1,23.4 2.45,21.95 2.45,18.45 2,18 2,15.9 2.5,15.4 4.7,15.4 5.3,14.8 5.3,11.1 3.7,9.5 3.7,6.6 4.5,5.8 v8.6,5.8
  Bottom 0.254: v26.51,27.43 24.1,29.84 14.4,29.84 v13.45,30.8 | v9,8.55 9,6.2 v8.6,5.8
SCL_5V0
  Top 0.254: Q3.3 13.97,5.95 13.97,1.65 14.61,1.02 18.8,1.02 JP2.5 21.18,3.4 R5.1
SDA_3V3  (via drill 0.39)
  Top 0.254: U1.8 26.4,25.87 v26.56,26.04 | 6.3,11.24 Q2.2 15.2,12.6 15.97,13.37 15.97,13.94 R1.1 | 6.3,11.24 6.14,11.24 4.9,10 4.9,7.62 VR1.S | v12.3,29.8 7.45,29.8 6.65,30.6 6.65,33.35 6.3,33.7 2.15,33.7 1.55,33.1 1.55,23.75 2.95,22.35 2.95,18.9 3.2,18.65 5.15,18.65 6.2,17.6 6.2,11.34 6.3,11.24
  Bottom 0.254: v26.56,26.04 25.75,26.85 25.75,27.43 23.84,29.34 12.76,29.34 v12.3,29.8
SDA_5V0  (via drill 0.39)
  Top 0.254: Q2.3 15.97,10.29 16.35,10.67 v16.35,12.45 | R4.1 19.02,3.78 JP2.4
  Bottom 0.254: v16.35,12.45 17.78,11.02 JP2.4
SHDN_3V3
  Top 0.254: U1.22 23.93,17.8 24.25,17.48 24.25,10.02 R12.1 23.75,8.09 D1.A
SHDN_5V
  Top 0.254: D1.C 23.97,3.97 JP2.7
SYNC_3V3  (via drill 0.39)
  Top 0.254: U1.25 25.9,16.15 25.24,15.49 25.24,12.95 25.75,12.45 R2.1 25.75,10.54 v25.62,10.41 | v32.61,10.03 D4.A
  Bottom 0.254: v25.62,10.41 30.83,10.41 31.21,10.03 v32.61,10.03
SYNC_5V
  Top 0.254: D4.C 32.61,2.95 JP2.10
SYNCOUT
  Top 0.254: U1.26 26.4,15.89 25.75,15.24 25.75,13.34 26.13,12.95 26.51,12.95 26.77,12.7 26.77,10.95 27.02,10.7 30.7,10.7 31.08,10.31 31.08,9.14 30.32,8.38 29.69,8.38 28.92,7.62 28.92,4.1 JP2.9
VDD  (via drill 0.39)
  Top 0.254: U1.30 28.4,16 28.2,16 | U1.29 27.9,16.1 28,16 28.2,16 | 28.2,15.9 28.2,16 | U1.4 28.4,27.1 C10.2 27.9,26.6 U1.5
  Top 0.406: C11.2 29.87,13.63 28.2,15.3 28.2,15.9
  Top 0.61: C2.1 U2.3 15.55,25.64 15.9,25.99 15.9,27.59 | 15.9,27.59 15.9,29.2 | U2.1 15.85,27.54 15.9,27.59 | C10.2 28.48,28.18 28.87,28.57 35.57,28.57 36.1,29.1 36.1,29.85
  Top 0.813: C11.2 29.89,13.5 35.8,13.5 38.35,10.95 43.55,10.95 45.5,9 45.5,4.86 JP2.14
  Top 1.016: 36.1,29.85 Q1.2 | v48.65,34.8 48.05,35.4 C3.1
  Top 1.27: C3.1 46.9,35.42 46.9,36.8 45.54,38.16 C1.+ 39.76,38.16 38.9,37.3 38.9,31.1 38.1,30.3 36.55,30.3 Q1.2
  Top 1.422: 15.9,29.2 15.9,31.7 19.6,35.4 22.6,35.4 25.3,32.7 33.37,32.7 Q1.2
  Bottom 1.016: v48.65,34.8 52.03,31.42 52.03,9 50.99,7.95 48.59,7.95 JP2.14
  pour Top (no thermals): 27.91,25.15 28.42,25.15 28.42,25.78 28.8,26.16 28.8,27.43 27.91,27.43
VDDIO
  Top 0.254: R4.2 R5.2 21.34,7.58 22.45,6.48 22.45,2.95 JP2.6

### Text on the board
tPlace: 12V | R | Left | L | MAX9744 / Class D | 4-8ΩBTL | Analog | Right | Pot. Vol | AD1 | AD2 | RIN | AGND | SCL | SHDN | SYNCO | AD1 | GND | LIN | SDA | Vi2c | MUTE | SYNC | AD2 | VDD
bPlace: MAX9744 20W Class D | Stereo Amplifier | 5-14VDC / Max! | For I2C Mode (default) / Keep Analog, AD1 & AD2 jumper open / Connect Vi2c to 3-5V. Addr is 0x4B / Close either AD1 or AD2 to change addr / Write 0x0-0x3F to I2C to set volume | For Analog mode / Close Analog, AD1 & AD2 jumpers / Or connect SCL/AD1/AD2 pins to Gnd / Connect 1K pot to three pads | BTL Outputs | Power per Channel | 13W @ 14V->8Ω / 22W @ 14V->4Ω | 10W @ 12V->8Ω / 17W @ 12V->4Ω | 1.8W @ 5V->8Ω / 3.6W @ 5V->4Ω